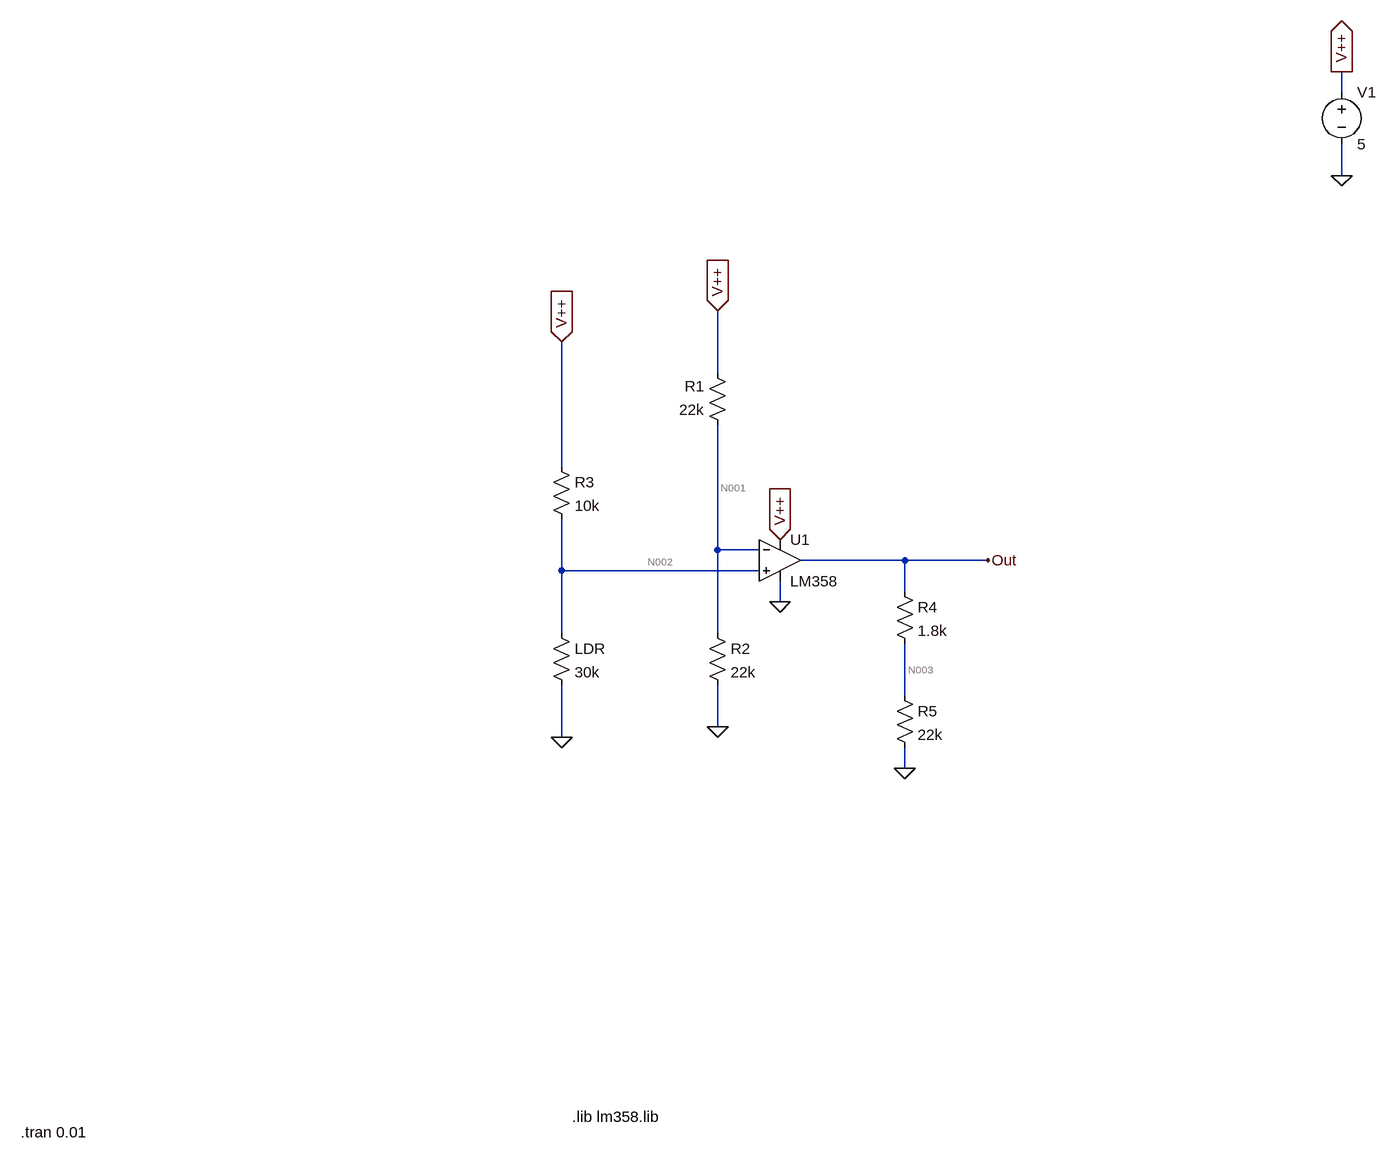
[diagram p0: schematic New_dark_detector.asc]
New_dark_detector.asc, the LTspice schematic file:
Version 4
SHEET 1 4800 756
WIRE 1072 -1344 1072 -1376
WIRE 1072 -1216 1072 -1264
WIRE 112 -912 112 -1008
WIRE -128 -768 -128 -960
WIRE 112 -640 112 -832
WIRE 176 -640 112 -640
WIRE 400 -624 240 -624
WIRE 528 -624 400 -624
WIRE -128 -608 -128 -688
WIRE 176 -608 -128 -608
WIRE 400 -576 400 -624
WIRE 208 -560 208 -592
WIRE -128 -512 -128 -608
WIRE 112 -512 112 -640
WIRE 400 -416 400 -496
WIRE 112 -368 112 -432
WIRE -128 -352 -128 -432
WIRE 400 -304 400 -336
FLAG 528 -624 Out
FLAG 1072 -1216 0
FLAG 1072 -1376 V++
IOPIN 1072 -1376 Out
FLAG 112 -1008 V++
IOPIN 112 -1008 In
FLAG 112 -368 0
FLAG 208 -560 0
FLAG 208 -656 V++
IOPIN 208 -656 In
FLAG -128 -352 0
FLAG -128 -960 V++
IOPIN -128 -960 In
FLAG 400 -304 0
SYMBOL OpAmps\\opamp2 208 -688 R0
SYMATTR InstName U1
SYMATTR Value LM358
SYMBOL res 128 -816 R180
WINDOW 0 36 76 Left 2
WINDOW 3 36 40 Left 2
SYMATTR InstName R1
SYMATTR Value 22k
SYMBOL voltage 1072 -1360 R0
WINDOW 123 0 0 Left 0
WINDOW 39 0 0 Left 0
SYMATTR InstName V1
SYMATTR Value 5
SYMBOL res 96 -528 R0
SYMATTR InstName R2
SYMATTR Value 22k
SYMBOL res -144 -528 R0
SYMATTR InstName LDR
SYMATTR Value 30k
SYMBOL res -144 -784 R0
SYMATTR InstName R3
SYMATTR Value 10k
SYMBOL res 384 -592 R0
SYMATTR InstName R4
SYMATTR Value 1.8k
SYMBOL res 384 -432 R0
SYMATTR InstName R5
SYMATTR Value 22k
TEXT -112 232 Left 2 !.lib lm358.lib
TEXT -960 256 Left 2 !.tran 0.01

The netlist it stands for:
* New_dark_detector.asc
XU1 N002 N001 V++ 0 Out LM358  ; pins In+ In- V+ V- OUT
R1 N001 V++ 22k
V1 V++ 0 5
R2 N001 0 22k
R§LDR N002 0 30k
R3 V++ N002 10k
R4 Out N003 1.8k
R5 N003 0 22k
.lib lm358.lib
.tran 0.01
.backanno
.end

* Results of the author's LTspice run, read from the files saved beside the schematic
* Operating Point, zero values left out:
*   V(out) = 3.791 V
*   V(v++) = 5 V
*   V(n001) = 2.5 V
*   V(n002) = 3.75 V
*   V(n003) = 3.504 V
*   I(R5) = 159.3 µA
*   I(R4) = 159.3 µA
*   I(R3) = 125 µA
*   I(Ldr) = 125 µA
*   I(R2) = 113.6 µA
*   I(R1) = -113.6 µA
*   I(V1) = -747.9 µA
*   Ix(u1:IN+) = -20 nA
*   Ix(u1:IN-) = -18 nA
*   Ix(u1:VCC) = 509.3 µA
*   Ix(u1:VEE) = -350 µA
*   Ix(u1:OUT) = -159.3 µA